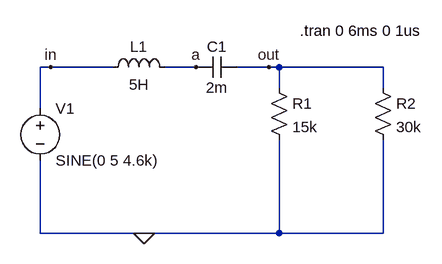
[diagram p0: schematic Draft1.asc]
Draft1.asc, the LTspice schematic file:
Version 4
SHEET 1 880 680
WIRE -112 96 -128 96
WIRE -16 96 -112 96
WIRE 112 96 64 96
WIRE 224 96 176 96
WIRE 240 96 224 96
WIRE 400 96 240 96
WIRE 240 128 240 96
WIRE 400 128 400 96
WIRE -128 160 -128 96
WIRE -128 352 -128 240
WIRE 32 352 -128 352
WIRE 240 352 240 208
WIRE 240 352 32 352
WIRE 400 352 400 208
WIRE 400 352 240 352
FLAG 32 352 0
FLAG -112 96 in
FLAG 224 96 out
FLAG 112 96 a
SYMBOL res 224 112 R0
SYMATTR InstName R1
SYMATTR Value 15k
SYMBOL res 384 112 R0
SYMATTR InstName R2
SYMATTR Value 30k
SYMBOL cap 176 80 R90
WINDOW 0 0 32 VBottom 2
WINDOW 3 32 32 VTop 2
SYMATTR InstName C1
SYMATTR Value 2m
SYMBOL voltage -128 144 R0
WINDOW 123 0 0 Left 0
WINDOW 39 0 0 Left 0
SYMATTR InstName V1
SYMATTR Value SINE(0 5 4.6k)
SYMBOL ind -32 112 R270
WINDOW 0 32 56 VTop 2
WINDOW 3 5 56 VBottom 2
SYMATTR InstName L1
SYMATTR Value 5H
TEXT 272 40 Left 2 !.tran 0 6ms 0 1us

The netlist it stands for:
* Draft1.asc
R1 out 0 15k
R2 out 0 30k
C1 out a 2m
V1 in 0 SINE(0 5 4.6k)
L1 in a 5H
.tran 0 6ms 0 1us
.backanno
.end

* Results of the author's LTspice run, read from the files saved beside the schematic
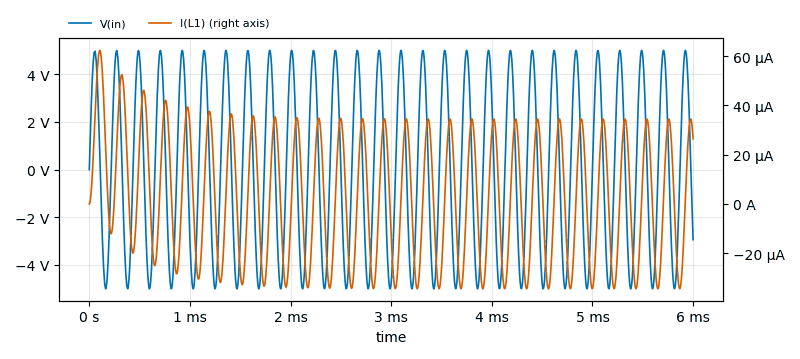
[diagram p1: Transient Analysis of Draft1.asc, plotted from the saved traces]
* Transient Analysis, 1 run:
*   V(in): min -5 V, max 5 V, average 51.85 mV, rms 3.53 V, last -2.939 V
*   I(L1): min -34.51 µA, max 62.4 µA, average 3.004 µA, rms 25.42 µA, last 26.45 µA